# EAGLE design femtoduinoBLE (EAGLE 6.5.0)
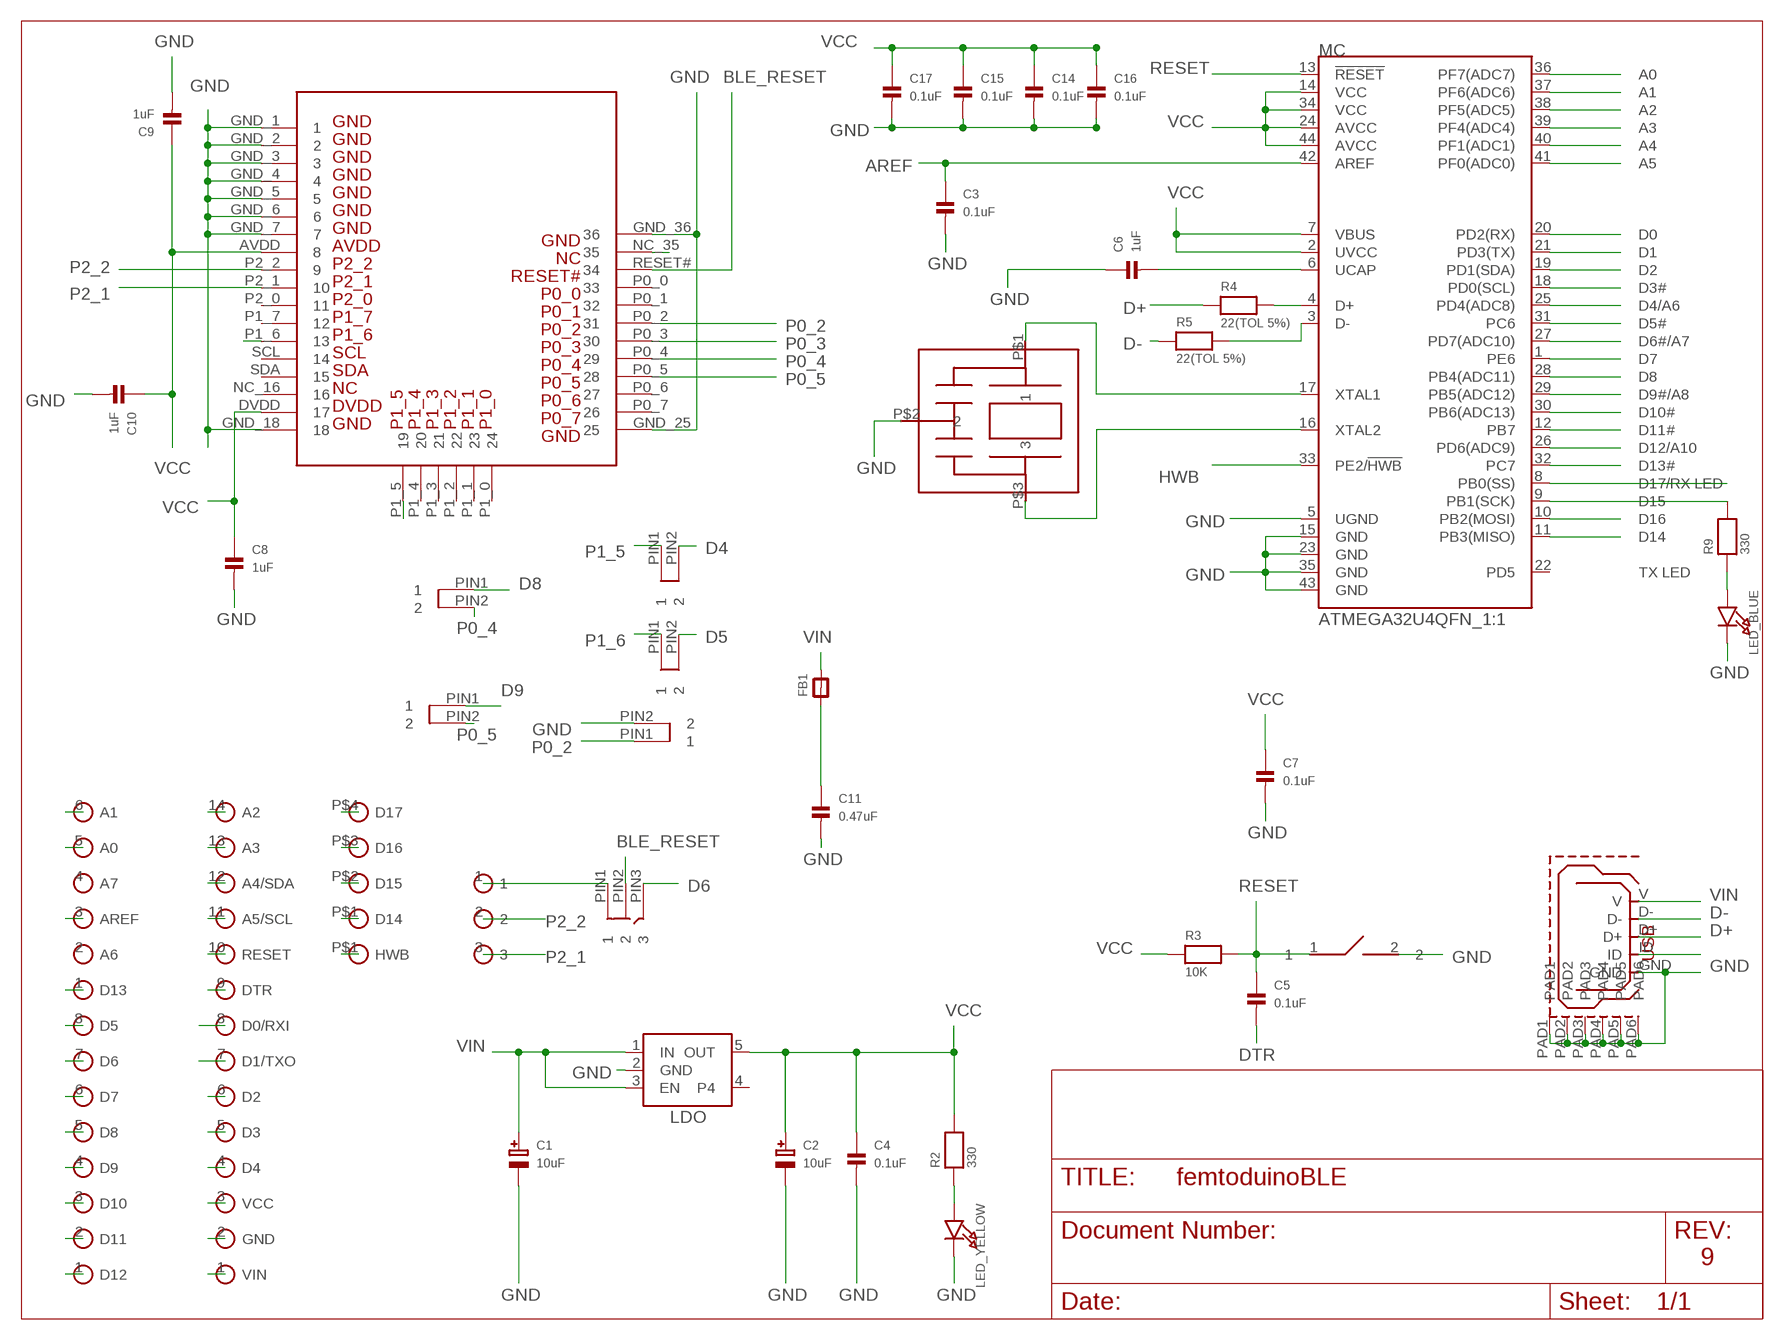
[diagram p0: schematic, sheet 1]

## Parts
BLE_CTS  DNP  SPST_SMD_BRIDGED  [SPST_SMD_BRIDGED]
C1  10uF  CAP_TANTALUMA/3216_REFLOW  [EIA3216-18/A-R]
C2  10uF  CAP_TANTALUMA/3216_REFLOW  [EIA3216-18/A-R]
C3  0.1uF  CAP_CERAMIC_0402  [_0402]
C4  0.1uF  CAP_CERAMIC_0402  [_0402]
C5  0.1uF  CAP_CERAMIC_0402  [_0402]
C6  1uF  CAP_CERAMIC_0402  [_0402]
C7  0.1uF  CAP_CERAMIC_0402  [_0402]
C8  1uF  CAP_CERAMIC0402  [0402]
C9  1uF  CAP_CERAMIC0402  [0402]
C10  1uF  CAP_CERAMIC0402  [0402]
C11  0.47uF  CAP_CERAMIC_0402  [_0402]
C14  0.1uF  CAP_CERAMIC_0402  [_0402]
C15  0.1uF  CAP_CERAMIC_0402  [_0402]
C16  0.1uF  CAP_CERAMIC_0402  [_0402]
C17  0.1uF  CAP_CERAMIC_0402  [_0402]
FB1  FERRITE  [0603]
LED_BLUE  LED0603_NOOUTLINE  [CHIPLED_0603_NOOUTLINE]
LED_YELLOW  LED0603_NOOUTLINE  [CHIPLED_0603_NOOUTLINE]
MC  ATMEGA32U4QFN_1:1  [QFN-44-NOPAD_1:1]
R2  330  RESISTOR_0402  [_0402]
R3  10K  RESISTOR_0402  [_0402]
R4  22(TOL 5%)  RESISTOR0402  [0402]
R5  22(TOL 5%)  RESISTOR0402  [0402]
R9  330  RESISTOR_0402  [_0402]
U$1  USB_MICROB  [USB_MICROB_PACKAGE]
U$2  CSTCE16MOV51-RO  [CSTCE16M0V51-RO_PACKAGE]
U$4  LDO_REGULATOR  [LDO_REGULATOR]
U$5  05_PINHEAD_1X6  [05_PINHEAD_1X6_PACKAGE]
U$6  05_PINHEAD_1X8  [05_PINHEAD_1X8_PACKAGE]
U$7  05_PINHEAD_1X14  [05_PINHEAD_1X14_PACKAGE]
U$9  DNP  SPST_SMD  [SPST_SMD]
U$10  05_PINHEAD_1X4  [05_PINHEAD_1X4_PACKAGE]
U$11  05_PINHEAD_1X1  [05_PINHEAD_1X1_PACKAGE]
U$12  BLE113-A  [BLE113-A]
U$13  DNP  SPST_SMD_BRIDGED  [SPST_SMD_BRIDGED]
U$14  DNP  SPST_SMD_BRIDGED  [SPST_SMD_BRIDGED]
U$15  DNP  SPST_SMD_BRIDGED  [SPST_SMD_BRIDGED]
U$16  DNP  SPST_SMD_BRIDGED  [SPST_SMD_BRIDGED]
U$19  DNP  SPST_3_SMD  [SPST_3_SMD]
U$20  05_PINHEAD_HEADER_1X3  [05_PINHEAD_1X3_HEAD_PACKAGE]

## Nets
A0: MC.36(PF7(ADC7)) U$5.5(A0)
A1: MC.37(PF6(ADC6)) U$5.6(A1)
A2: MC.38(PF5(ADC5)) U$7.14(A2)
A3: MC.39(PF4(ADC4)) U$7.13(A3)
A4: MC.40(PF1(ADC1)) U$7.12(A4/SDA)
A5: MC.41(PF0(ADC0)) U$7.11(A5/SCL)
AREF: C3.1 MC.42(AREF) U$5.3(AREF)
BLE_RESET: U$12.RESET# U$19.PIN2
D2: MC.19(PD1(SDA)) U$7.6(D2)
D3: MC.18(PD0(SCL)) U$7.5(D3)
D4: MC.25(PD4(ADC8)) U$7.4(D4) U$16.PIN2
D5: MC.31(PC6) U$6.8(D5) U$15.PIN2
D6: MC.27(PD7(ADC10)) U$6.7(D6) U$19.PIN3
D7: MC.1(PE6) U$6.6(D7)
D8: MC.28(PB4(ADC11)) U$6.5(D8) U$13.PIN1
D9: MC.29(PB5(ADC12)) U$6.4(D9) U$14.PIN1
D10: MC.30(PB6(ADC13)) U$6.3(D10)
D11: MC.12(PB7) U$6.2(D11)
D12: MC.26(PD6(ADC9)) U$6.1(D12)
D13: MC.32(PC7) U$5.1(D13)
D14: MC.11(PB3(MISO)) U$10.P$1(D14)
D15: MC.9(PB1(SCK)) R9.2 U$10.P$2(D15)
D16: MC.10(PB2(MOSI)) U$10.P$3(D16)
D17: MC.8(PB0(SS)) U$10.P$4(D17)
D+: R4.1 U$1.D+
D-: R5.1 U$1.D-
DTR: C5.2 U$7.9(DTR)
GND: BLE_CTS.PIN2 C1.- C2.- C3.2 C4.2 C6.1 C7.2 C8.2 C9.2 C10.2 C11.2 C14.2 C15.2 C16.2 C17.2 LED_BLUE.C LED_YELLOW.C MC.5(UGND) MC.15(GND) MC.23(GND) MC.35(GND) MC.43(GND) U$1.GND U$1.PAD1 U$1.PAD2 U$1.PAD3 U$1.PAD4 U$1.PAD5 U$1.PAD6 U$2.P$2 U$4.2(GND) U$7.2(GND) U$9.2 U$12.GND_1 U$12.GND_2 U$12.GND_3 U$12.GND_4 U$12.GND_5 U$12.GND_6 U$12.GND_7 U$12.GND_18 U$12.GND_25 U$12.GND_36
HWB: MC.33(PE2/!HWB) U$11.P$1(HWB)
N$1: C11.1 FB1.1
N$2: U$12.NC_35
N$4: LED_BLUE.A R9.1
N$5: LED_YELLOW.A R2.1
N$8: U$19.PIN1 U$20.1
N$10: U$1.ID
N$11: MC.4(D+) R4.2
N$23: MC.3(D-) R5.2
P0_2: BLE_CTS.PIN1 U$12.P0_2
P0_3: U$12.P0_3
P0_4: U$12.P0_4 U$13.PIN2
P0_5: U$12.P0_5 U$14.PIN2
P1_5: U$12.P1_5 U$16.PIN1
P1_6: U$12.P1_6 U$15.PIN1
P2_1: U$12.P2_1 U$20.3
P2_2: U$12.P2_2 U$20.2
RESET: C5.1 MC.13(!RESET) R3.2 U$7.10(RESET) U$9.1
RXI: MC.20(PD2(RX)) U$7.8(D0/RXI)
TXO: MC.21(PD3(TX)) U$7.7(D1/TXO)
UCAP: C6.2 MC.6(UCAP)
VCC: C2.+ C4.1 C7.1 C8.1 C9.1 C10.1 C14.1 C15.1 C16.1 C17.1 MC.2(UVCC) MC.7(VBUS) MC.14(VCC) MC.24(AVCC) MC.34(VCC) MC.44(AVCC) R2.2 R3.1 U$4.5(OUT) U$7.3(VCC) U$12.AVDD U$12.DVDD
VIN: C1.+ FB1.2 U$1.V U$4.1(IN) U$4.3(EN) U$7.1(VIN)
XTAL1: MC.17(XTAL1) U$2.P$1
XTAL2: MC.16(XTAL2) U$2.P$3
Unconnected: MC.22(PD5) U$4.4 U$5.2(A6) U$5.4(A7) U$12.NC_16 U$12.P0_0 U$12.P0_1 U$12.P0_6 U$12.P0_7 U$12.P1_0 U$12.P1_1 U$12.P1_2 U$12.P1_3 U$12.P1_4 U$12.P1_7 U$12.P2_0 U$12.SCL U$12.SDA

## Notes on the sheet
- 9

## Library data of the parts
BLE_CTS U$13-U$16 = ftdi_ft231xq-r:SPST_SMD_BRIDGED
C1 C2 = microbuilder:CAP_TANTALUM: Tantalum Capacitors Wave footprints have larger pads and are meant to be used for hand soldering. Reflow footprints are optimised for solder paste and a reflow oven. EIA3216-18/A-[R/W] - Size A / 3216-18 / 1206 footprint 4.7µF 25V 10% Tantalum Capacitor 10µF 16V 10% Tantalum Capacitor [Digikey: 495-2236-2-ND] EIA3528-21/B-[R/W] - Size B / 3528-21 47µF 10V 10% Tantalum Capactior [Digikey: 495-2216-1-ND] EIA6032-28/C-[R/W] - Size C / 6032-28 10µF 35V 20% Tantalum Capacitor [Digikey: 495-2285-1-ND] 100µF 16V 10% Tantalum Capactior [Digikey: 399-5214-1-ND]
C3-C11 C14-C17 = microbuilder:CAP_CERAMIC: Ceramic Capacitors 0402 - 0402 Surface Mount Capacitors 16pF 50V 5% [Digikey: 445-4899-2-ND] 18pF 50V 5% [Digikey: 490-1281-2-ND] 22pF 50V 5% [Digikey: 490-1283-2-ND] 68pF 50V 5% [Digikey: 490-1289-2-ND] 0.1uF 10V 10% [Digikey: 490-1318-2-ND] 1.0uF 6.3V 10% [Digikey: 490-1320-2-ND] 0603 - 0603 Surface Mount Capacitors 16 pF 50V 5% [Digikey: 445-5051-2-ND] 22 pF 50V [Digikey: PCC220ACVTR-ND] 33 pF 50V 5% [Digikey: 490-1415-1-ND] 56pF 50V 5% [Digikey: 490-1421-1-ND] 220pF 50V 5% [Digikey: 445-1285-1-ND] 680 pF 50V 2200 pF 50V 5% C0G [Digikey: 445-1297-1-ND] 5600 pF 100V 5% X7R [Digikey: 478-3711-1-ND] 0.1 µF 25V 10% [Digikey: PCC2277TR-ND] 0.22 µF 16V 10% X7R [Digikey: 445-1318-1-ND] 1.0 µF 25V 10% [Digikey: 445-5146-2-ND] 0603 - RF Specific 3pF 250V +/-0.1pF RF [Digikey: 712-1347-1-ND] 18 pF 250V 5% [Digikey: 478-3505-1-ND or 712-1322-1-ND] 56 pF 250V 5% C0G RF [Digikey: 490-4867-1-ND] 68 pF 250V RF [Digikey: 490-4868-1-ND] 0805 - 0805 Surface Mount Capacitors 220 pF 250V 2% RF Ceramic Capacitor [Digikey: 712-1398-1-ND] 1000 pF 50V 2% NP0 Ceramic Capacitor [Digikey: 478-3760-1-ND] 0.1 µF 25V 10% Ceramic Capacitor [Digikey: PCC1828TR-ND] 1.0 µF 16V 10% Ceramic Capacitor[Digikey: 490-1691-2-ND] 10.0 µF 10V 10% Ceramic Capacitor[Digikey: 709-1228-1-ND] 10.0 uF 16V 10% Ceramic Capacitor [Digikey: 478-5165-2-ND] 47 uF 6.3V 20% Ceramic Capacitor [Digikey: 587-1779-1-ND or 399-5506-1-ND] 1206 - 1206 Surface Mount Capacitors 47uF 10V 20% Ceramic Capacitor [Digikey: 490-5528-1-ND or 399-5508-1-ND or 445-6010-1-ND] 100uF 6.3V -20%, +80% Y5V Ceramic Capacitor (Digikey: 490-4512-1-ND, Mouser: 81-GRM31CF50J107ZE1L)
FB1 = microbuilder:FERRITE: Ferrite Bead 0603 MMZ1608B121C - 120 Ohm @ 100MHz, 600mA, 0.15 Ohm DC Resistance - Digikey: 445-2164-1-ND BK1608HW121-T - 120 Ohm, 600mA Ferrite Chip - Digikey: 587-1876-2-ND 0805 HZ0805B272R-10 - 2.7K Ohm @ 100MHz, 200mA, 0.8 Ohm DC Resistance - Digikey: 240-2504-1-ND (see also Murata BLM21BD272SN1L) MMZ2012Y152B - 1.5K Ohm @ 100MHz, 500mA, 0.4 Ohm DC Resistance - Digikey: 445-1560-1-ND - Mainly for high frequency (80-400MHz) MMZ2012R102A - 1K Ohm @ 100MHz, 500mA, 0.3 Ohm DC Resistance - Digikey: 445-1555-2-ND - More general purpose (10-200MHz)
LED_BLUE LED_YELLOW = microbuilder:LED: LED 0603 - 0603 Surface Mount Package 2mA: Green LED - Low Power (3.9mcd, 2ma, 1.7Vf) - Digikey: 475-2709-2-ND Orange LED - Low Power (9.8mcd, 2ma, 1.8Vf) - Digikey: 475-1194-2-ND Red LED - Low Power (5mcd, 2ma, 1.8Vf) - Digikey: 475-1195-2-ND Yellow LED - Low Power (7mcd, 2ma, 1.8Vf) - Digikey: 475-1196-2-ND 5mA: Blue LED - Low Power (17mcd, 5ma, 2.9Vf) - Digikey: LNJ937W8CRACT-ND 0805 - 0805 Surface Mount Package 2mA: Red LED (8.8mcd, 2mA, 1.8Vf, Clear) - Low Power [Digikey: 475-2510-1-ND] Green LED (5mcd, 2mA, 1.8Vf, Clear) - Low Power [Digikey: 475-2730-1-ND] Yellow LED (11.3mcd, 2mA, 1.8Vf, Clear) - Low Power [Digikey: 475-2555-1-ND] 20mA: Red LED (104mcd, 20mA, Diffused) - LS R976 [Digikey: 475-1278-6-ND] Red LED (12mcd, 20mA, 2.0Vf, Clear) - APT2012EC [Digikey: 754-1128-1-ND] Green LED (15mcd, 20mA, 2.2Vf, Clear) - APT2012GC [Digikey: 754-1131-1-ND] Orange LED (160mcd, 20mA, 2.1Vf, Clear) - APT2012SECK [Digikey: 754-1130-1-ND] 1206 - 1206 Surface Mount Package Green LED (26mcd, 20mA, Diffused) - LG N971 [Digikey: 475-1407-6-ND] Red LED (15mcd, 20mA, Diffused) - LH N974 [Digikey: 475-1416-6-ND]
MC = SparkFun-DigitalIC:ATMEGA32U4: Atmel 44-pin 8-bit Microcontroller with 32KBytes of ISP Flash and USB Controller ----- Please use the QFN-44-NOPAD_1:1 package for the footprint of all boards using a 32U4. Route traces directly away from the pads as much as possible.
R2-R5 R9 = microbuilder:RESISTOR: Resistors 0402 - 0402 Surface Mount Package 22 Ohm 1% 1/16W [Digikey: 311-22.0LRTR-ND] 33 Ohm 5% 1/16W 1.0K 5% 1/16W 1.5K 5% 1/16W 2.0K 1% 1/16W 10.0K 1% 1/16W [Digikey: 311-10.0KLRTR-ND] 10.0K 5% 1/16W [Digikey: RMCF0402JT10K0TR-ND] 12.1K 1% 1/16W [Digikey: 311-22.0LRTR-ND] 100.0K 5% 1/16W 0603 - 0603 Surface Mount Package 0 Ohm 1/10 Watt 1% Resistor 15 Ohm 1/10 Watt 1% Resistor 33 Ohm 1/10 Watt 1% Resistor 49.9 Ohm 1/10 Watt 1% Resistor 100 Ohm 1/10 Watt 1% Resistor 150 Ohm 1/10 Watt 1% Resistor 240 Ohm 1/10 Watt 1% Resistor 390 Ohm 1/10 Watt 1% Resistor 560 Ohm 1/10 Watt 1% Resistor 680 Ohm 1/10 Watt 1% Resistor 750 Ohm 1/10 Watt 1% Resistor 1.0K Ohm 1/10 Watt 1% Resistor 1.5K Ohm 1/10 Watt 1% Resistor 2.0K Ohm 1/10 Watt 1% Resistor 2.2K Ohm 1/10 Watt 1% Resistor 3.3K Ohm 1/10 Watt 1% Resistor 4.7K Ohm 1/10 Watt 1% Resistor 10.0K Ohm 1/10 Watt 1% Resistor 12.0K Ohm 1/10 Watt 1% Resistor 12.1K Ohm 1/10 Watt 1% Resistor 20.0K Ohm 1/10 Watt 1% Resistor 33.0K Ohm 1/10 Watt 1% Resistor 100.0K Ohm 1/10 Watt 1% Resistor 0805 - 0805 Surface Mount Package 0 Ohm 1/8 Watt 1% Resistor 33 Ohm 1/8 Watt 1% Resistor 100 Ohm 1/8 Watt 1% Resistor 150 Ohm 1/8 Watt 1% Resistor 200 Ohm 1/8 Watt 1% Resistor 240 Ohm 1/8 Watt 1% Resistor 330 Ohm 1/8 Watt 1% Resistor 390 Ohm 1/8 Watt 1% Resistor 470 Ohm 1/8 Watt 1% Resistor 1.0K Ohm 1/8 Watt 1% Resistor 1.5K Ohm 1/8 Watt 1% Resistor 2.0K Ohm 1/8 Watt 1% Resistor 4.7K Ohm 1/8 Watt 1% Resistor 5.1K Ohm 1/8 Watt 1% Resistor 5.6K Ohm 1/8 Watt 1% Resistor 10.0K Ohm 1/8 Watt 1% Resistor 22.0K Ohm 1/8 Watt 1% Resistor 33.0K Ohm 1/8 Watt 1% Resistor 100K Ohm 1/8 Watt 1% Resistor 1206 - 1206 Surface Mount Package 2012 - 2010 Surface Mount Package 0.11 Ohm 1/2 Watt 1% Resistor - Digikey: RHM.11UCT-ND
U$1 = femtoduino:USB_MICROB: This is the hirose ZX62-B-5PA(11) MICRO-USB B Type female connection.
U$2 = femtoduino:CSTCE16MOV51-RO: This is the CSTCE16M0V51-R0 Murata resonator (CERALOCK) 16Mhz 0.5% Tolerance
U$4 = femtoduino:LDO_REGULATOR
U$5 = femtoduino:05_PINHEAD_1X6
U$6 = femtoduino:05_PINHEAD_1X8
U$7 = femtoduino:05_PINHEAD_1X14
U$9 = femtoduino:SPST_SMD
U$10 = femtoduino:05_PINHEAD_1X4
U$11 = femtoduino:05_PINHEAD_1X1
U$12 = BLE113-A:BLE113-A
U$19 = ftdi_ft231xq-r:SPST_3_SMD
U$20 = femtoduino:05_PINHEAD_HEADER_1X3

## Board
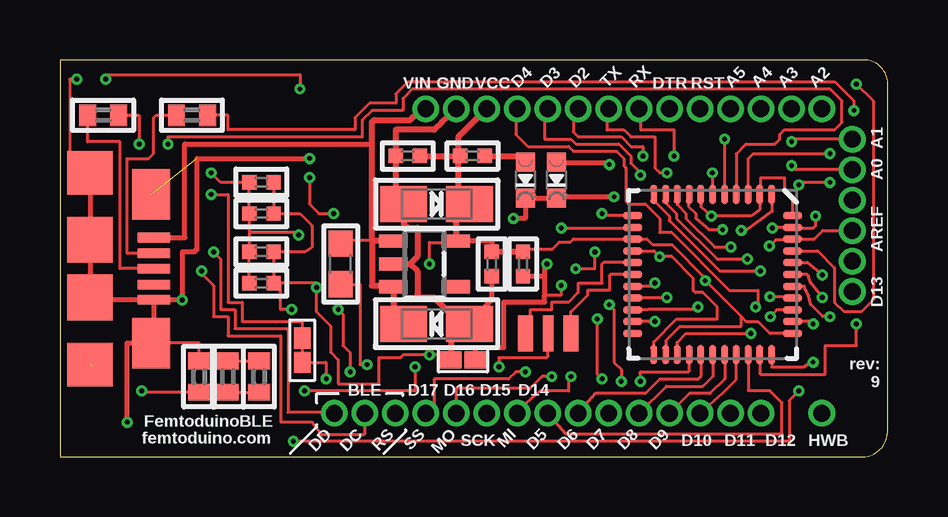
[diagram p1: board, top side]
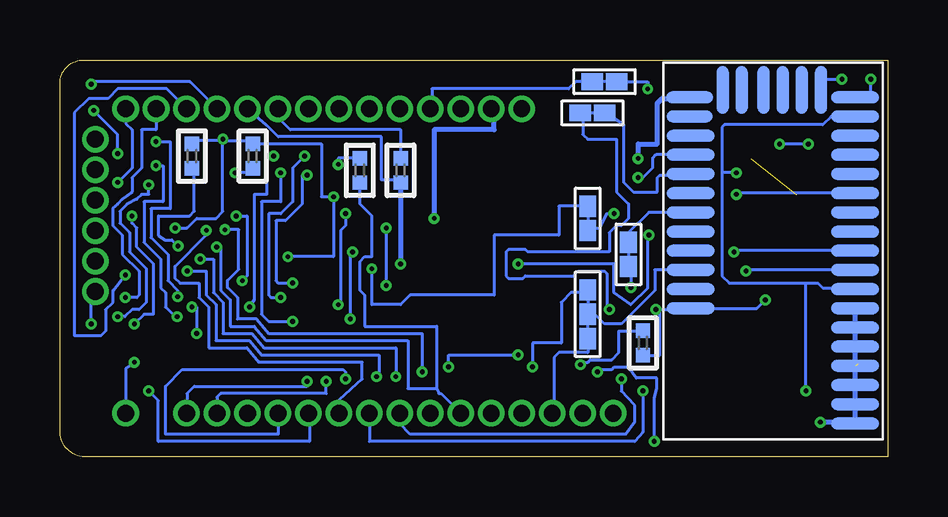
[diagram p2: board, bottom side, seen from below]

Size 34.5 x 16.56 mm. Coordinates in mm from the lower left corner, seen from the top.
Outline: 0,0 33.38,0 arc90 34.5,1.02 34.5,15.67 arc90 33.42,16.55 0,16.55 0,0
Copper layers (1+2*15+16): Top 0.035mm / dielectric 1.5mm / Route2 0.035mm / dielectric 0.15mm / Route15 0.035mm / dielectric 0.2mm / Bottom 0.035mm
Design rules "femtoduino_5mil_4layer *": minimum track width 5mil, minimum drill 2mil, track to track 5mil, track to pad 5mil, pad to pad 5mil, via to via 5mil, smd to smd 5mil, copper to edge 5mil, drill to drill 5mil, minimum pad ring 8mil, minimum via ring 5mil, stop-mask expansion 2mil, vias tented up to drill 30mil, thermal gap 10mil

### Footprints (pad centres in the part's own frame; a part is rotated, then mirrored left to right if it is on the bottom)
SPST_SMD_BRIDGED = smd 0.889 x 0.699: PIN1 -0.508,0; PIN2 0.508,0
EIA3216-18/A-R = smd 1.95 x 1.5: + 1.375,0; - -1.375,0
_0402 = smd 0.6 x 0.6: 1 -0.508,0; 2 0.508,0
0402 = smd 0.7 x 0.9: 1 -0.65,0; 2 0.65,0
0603 = smd 1.1 x 1: 1 -0.85,0; 2 0.85,0
CHIPLED_0603_NOOUTLINE = smd 0.8 x 0.8: A 0,-0.75; C 0,0.75
QFN-44-NOPAD_1:1 = smd 0.8 x 0.3: 1 -3.337,2.458; 2 -3.337,1.958; 3 -3.337,1.479; 4 -3.337,0.979; 5 -3.337,0.5; 6 -3.337,0; 7 -3.337,-0.5; 8 -3.337,-0.979; 9 -3.337,-1.479; 10 -3.337,-1.958; 11 -3.337,-2.458; 23 3.337,-2.458; 24 3.337,-1.958; 25 3.337,-1.479; 26 3.337,-0.979; 27 3.337,-0.5; 28 3.337,0; 29 3.337,0.5; 30 3.337,0.979; 31 3.337,1.479; 32 3.337,1.958; 33 3.337,2.458 | smd 0.3 x 0.8: 12 -2.458,-3.337; 13 -1.958,-3.337; 14 -1.479,-3.337; 15 -0.979,-3.337; 16 -0.5,-3.337; 17 0,-3.337; 18 0.5,-3.337; 19 0.979,-3.337; 20 1.479,-3.337; 21 1.958,-3.337; 22 2.458,-3.337; 34 2.458,3.337; 35 1.958,3.337; 36 1.479,3.337; 37 0.979,3.337; 38 0.5,3.337; 39 0,3.337; 40 -0.5,3.337; 41 -0.979,3.337; 42 -1.479,3.337; 43 -1.958,3.337; 44 -2.458,3.337
USB_MICROB_PACKAGE = smd 0.4 x 1.35: D+ 0,-0.68; D- -0.64,-0.68; GND 1.3,-0.68; ID 0.66,-0.68; V -1.3,-0.68 | smd 2.1 x 1.6: PAD1 -3.1,-0.8; PAD2 3.1,-0.8 | smd 1.8 x 1.9: PAD3 -4,-3.35; PAD6 4,-3.35 | smd 1.9 x 1.9: PAD4 -1.2,-3.35; PAD5 1.2,-3.35
CSTCE16M0V51-RO_PACKAGE = smd 1.5 x 0.62: P$1 0,1.9; P$3 0,0 | smd 1.5 x 0.45: P$2 0,0.95
LDO_REGULATOR = smd 0.55 x 1.2: 1 -0.95,-1.3; 2 0,-1.3; 3 0.95,-1.3; 4 0.95,1.3; 5 -0.95,1.3
05_PINHEAD_1X6_PACKAGE = drill 0.7 pad 1.016: 1 0,0; 2 0,1.27; 3 0,2.54; 4 0,3.81; 5 0,5.08; 6 0,6.35
05_PINHEAD_1X8_PACKAGE = drill 0.7 pad 1.016: 1 0,0; 2 0,1.27; 3 0,2.54; 4 0,3.81; 5 0,5.08; 6 0,6.35; 7 0,7.62; 8 0,8.89
05_PINHEAD_1X14_PACKAGE = drill 0.7 pad 1.016: 1 0,0; 2 0,1.27; 3 0,2.54; 4 0,3.81; 5 0,5.08; 6 0,6.35; 7 0,7.62; 8 0,8.89; 9 0,10.16; 10 0,11.43; 11 0,12.7; 12 0,13.97; 13 0,15.24; 14 0,16.51
SPST_SMD = smd 0.889 x 0.699: 1 -0.508,0; 2 0.508,0
05_PINHEAD_1X4_PACKAGE = drill 0.7 pad 1.016: P$1 0,0; P$2 0,1.27; P$3 0,2.54; P$4 0,3.81
05_PINHEAD_1X1_PACKAGE = drill 0.7 pad 1.016: P$1 0,0
BLE113-A = smd 2 x 0.5: AVDD 1.15,9.45; DVDD 1.15,2.25; GND_1 1.15,15.05; GND_2 1.15,14.25; GND_3 1.15,13.45; GND_4 1.15,12.65; GND_5 1.15,11.85; GND_6 1.15,11.05; GND_7 1.15,10.25; GND_18 1.15,1.45; GND_36 8,10.25; NC_16 1.15,3.05; NC_35 8,9.45; P0_0 8,7.85; P0_1 8,7.05; P0_2 8,6.25; P0_3 8,5.45; P0_4 8,4.65; P0_5 8,3.85; P0_6 8,3.05; P1_6 1.15,5.45; P1_7 1.15,6.25; P2_0 1.15,7.05; P2_1 1.15,7.85; P2_2 1.15,8.65; RESET# 8,8.65; SCL 1.15,4.65; SDA 1.15,3.85 | smd 1.95 x 0.5: GND_25 8.05,1.45 | smd 1.9 x 0.5: P0_7 8.05,2.25 | smd 0.5 x 2: P1_0 6.675,1.15; P1_1 5.875,1.15; P1_2 4.975,1.15; P1_3 4.175,1.15; P1_4 3.375,1.15; P1_5 2.575,1.15
SPST_3_SMD = smd 0.889 x 0.699: PIN1 -1.016,0; PIN2 0,0; PIN3 1.016,0
05_PINHEAD_1X3_HEAD_PACKAGE = drill 0.7 pad 1.016: 1 0,0; 2 0,-1.27; 3 0,-2.54

### Placement (x,y rotation side)
BLE_CTS  10.8,8.45 270 bottom
C1  15.7,5.55 180 top
C2  15.7,10.55 0 top
C3  29,12.55 90 bottom
C4  14.5,12.55 180 top
C5  20.3,11.95 90 bottom
C6  26.47,12.55 270 bottom
C7  18,8.05 270 top
C8  5.8,3.35 90 top
C9  7,3.35 90 top
C10  8.3,3.35 90 top
C11  10.2,4.75 270 bottom
C14  8.4,7.25 0 top
C15  8.4,8.55 0 top
C16  8.4,10.15 0 top
C17  8.4,11.45 0 top
FB1  11.7,8.05 90 top
LED_BLUE  20.7,11.55 180 top
LED_YELLOW  19.4,11.55 180 top
MC  27.21,7.61 270 top
R2  17.2,12.55 180 top
R3  19.3,8.05 270 top
R4  1.8,14.25 0 top
R5  5.5,14.25 0 top
R9  22,11.95 270 bottom
U$1  4.6,7.85 270 top
U$2  19.4,5.15 270 top
U$4  15.2,8.05 270 top
U$5  33.03,6.9 0 top
U$6  29.22,1.82 90 top
U$7  15.25,14.52 270 top
U$9  16.8,4.05 180 top
U$10  19.06,1.82 90 top
U$11  31.76,1.82 0 top
U$12  0.2,16.45 180 bottom
U$13  12.3,14.35 0 bottom
U$14  12.5,9.95 270 bottom
U$15  10.1,4.45 270 top
U$16  11.8,15.65 180 bottom
U$19  12.5,5.95 90 bottom
U$20  13.98,1.82 270 top

### Tracks (layer width: path | path; a pad name or v marks a point on that pad's centre or on a via)
A0  (via drill 0.2)
  Top 0.127: U$5.5 30.67,11.98 v30.5,12.15 | MC.36 29.88,6.13 v29.62,5.85
  Bottom 0.127: v30.5,12.15 30.2,12.15 30.2,10.65 31,10.65 31,8.95 30.3,8.25 30.3,7.05 30.1,6.85 30.1,6.25 29.7,5.85 v29.62,5.85
A1  (via drill 0.2)
  Top 0.127: U$5.6 30.6,13.25 v30.5,13.15 | MC.37 30.53,6.65 30.53,6.68 v29.6,6.68
  Bottom 0.127: v30.5,13.15 29.9,13.15 29.9,10.35 30.7,10.35 30.7,9.15 30,8.45 30,7.35 29.6,6.95 v29.6,6.68
A2  (via drill 0.2)
  Top 0.127: MC.38 31.04,7.11 31.1,6.95 31.2,6.75 31.3,6.35 31.8,5.85 v32.1,5.85 | v32.1,11.45 30.9,11.45 v30.8,11.35
  Bottom 0.127: U$7.14 31.76,13.91 31.5,13.65 31.5,12.05 v32.1,11.45 | v30.8,11.35 30.8,10.95 31.1,10.95 31.3,10.75 31.7,10.55 32,10.25 32,9.75 31.6,9.35 31.6,8.55 30.9,7.85 30.9,6.45 31.2,6.15 31.5,6.15 31.8,5.85 v32.1,5.85
A3  (via drill 0.2)
  Top 0.127: 30.94,7.61 MC.39 31.14,7.61 31.2,7.55 31.3,7.25 v31.77,6.66
  Bottom 0.127: U$7.13 30.49,13.66 30.5,13.65 31.1,13.65 31.1,12.05 31.5,11.65 31.5,11.05 31.9,10.75 32.1,10.55 32.3,10.38 32.3,9.65 31.9,9.25 31.9,8.45 31.2,7.75 31.2,6.75 31.3,6.65 v31.77,6.66
A4  (via drill 0.2)
  Top 0.127: MC.40 31.16,8.11 v31.77,7.58
  Bottom 0.127: U$7.12 30.05,15.35 32.1,15.35 32.5,14.95 33.3,14.95 33.9,14.35 33.9,5.05 32.8,5.05 32.6,5.25 32.6,6.15 32.28,6.45 32.28,6.95 v31.77,7.58
A5  (via drill 0.2)
  Top 0.127: MC.41 31.59,8.59 32.28,7.88 32.28,6.45 32.7,6.05 33.4,6.05 33.9,6.55 33.9,14.85 v33.2,15.55
  Bottom 0.127: U$7.11 29.08,15.65 33.1,15.65 v33.2,15.55
AREF  (via drill 0.2)
  Top 0.127: U$5.3 31.8,9.45 31.44,9.09 MC.42 30.51,9.05 29.84,9.05 v29.58,8.8
  Bottom 0.127: 28.95,11.85 C3.1 28.9,11.8 28.9,10.25 29.1,10.05 30.4,10.05 30.4,9.24 30.12,9.05 29.84,9.05 v29.58,8.8
BLE_RESET
  Bottom 0.127: U$12.RESET# 9.7,7.8 9.7,6.95 11.1,5.55 11.8,5.55 12.2,5.95 U$19.PIN2
D2  (via drill 0.2)
  Top 0.127: U$7.6 21.4,14.42 21.4,13.55 21.6,13.35 23.4,13.35 23.8,12.95 24.3,12.95 v24.3,12.55 | v25.3,6.65 25.18,6.63 MC.19
  Bottom 0.127: v24.3,12.55 24.8,12.05 24.8,10.65 25.3,10.15 25.8,10.15 25.8,6.75 25.7,6.65 v25.3,6.65 | U$7.6
D3  (via drill 0.2)
  Top 0.127: U$7.5 20.2,14.45 20.2,13.25 21.3,13.25 21.5,13.05 23.3,13.05 23.8,12.55 23.8,12.25 24.2,11.85 v24.2,11.75 | v24.8,7.25 24.66,7.11 MC.18
  Bottom 0.127: v24.2,11.75 24.4,11.75 24.4,10.55 25.1,9.85 25.5,9.85 25.5,7.35 25.4,7.25 v24.8,7.25
D4  (via drill 0.2)
  Top 0.127: U$7.4 19,14.48 19,13.45 19.5,12.95 21.2,12.95 21.4,12.75 23.2,12.75 23.5,12.45 23.5,12.15 23.6,12.05 23.6,10.65 23.7,10.55 24.4,10.55 25,9.95 25,9.35 25.5,9.35 27.9,6.95 29.1,6.95 29.1,6.25 v29,6.25 | MC.25 25.73,4.78 26.1,5.15 v28.8,5.15
  Bottom 0.127: v29,6.25 28.8,6.25 v28.8,5.15 | U$16.PIN2 13,15.65 13.3,15.35 19,15.35 19,14.58 U$7.4
D5  (via drill 0.2 pad 0.25)
  Top 0.127: MC.31 28.69,2.76 29.6,2.76 30.1,2.26 30.1,0.95 21.1,0.95 U$6.8 | U$15.PIN2 11.09,3.95 v11.1,3.25
  Bottom 0.127: v11.1,3.25 11.1,2.75 10.54,2.15 10.54,1.47 10.92,0.95 19.9,0.95 20.33,1.38 U$6.8
D6  (via drill 0.2 pad 0.25)
  Top 0.127: U$6.7 22.33,2.65 24.4,2.65 25,3.25 26.6,3.25 26.71,3.36 MC.27 | v14.8,3.75 14.8,2.75 v10.2,2.75
  Bottom 0.127: U$19.PIN3 12.62,6.85 13.2,6.85 13.6,6.45 13.6,4.75 14.8,4.75 v14.8,3.75 | v10.2,2.75 10.2,1.03 10.54,0.65 21.6,0.65 U$6.7
D7  (via drill 0.2)
  Top 0.127: v28.4,9.45 28.6,9.45 29.7,10.25 29.7,10.91 MC.1
  Bottom 0.127: v28.4,9.45 28.4,9.25 29.7,7.95 29.7,7.45 29.5,7.25 28.7,7.25 28.7,6.65 28.3,6.25 28.3,4.55 26.7,4.55 26.2,3.95 21.9,3.95 21.9,3.25 22.87,2.38 U$6.6
D8  (via drill 0.2)
  Top 0.127: MC.28 27.21,3.36 26.8,2.95 25.27,2.95 U$6.5 | v11.6,6.15 11.8,5.95 11.8,4.65 12.1,4.35 v12.1,3.55 | v30.8,2.75 30.4,2.35 30.4,0.65 v9.73,0.65
  Bottom 0.127: U$13.PIN1 12.7,14.24 12.7,13.45 12.5,13.25 11.3,13.25 11.3,11.05 10.8,10.55 10.8,9.95 11.1,9.65 11.3,9.65 11.6,9.35 11.6,8.55 15,8.55 15.1,8.65 15.8,8.65 15.9,8.55 15.9,7.55 15.8,7.45 15.2,7.45 15.1,7.55 13.1,7.55 12.9,7.75 11.8,7.75 11.7,7.65 11.7,6.25 v11.6,6.15 | U$6.5 24.1,1.78 24.1,0.65 30.4,0.65 30.4,2.35 v30.8,2.75 | v12.1,3.55 12,3.65 11.5,3.65 11.4,3.75 10.8,3.75 10.47,3.3 9.62,3.3 9.62,2.87 9.73,2.47 v9.73,0.65
D9  (via drill 0.2)
  Top 0.127: U$6.4 26.24,2.65 27.1,2.65 27.71,3.26 MC.29 | v22.6,3.25 22.4,3.45 v22.4,5.75 | v21.5,7.85 22.3,7.85 v22.3,8.55
  Bottom 0.127: U$14.PIN1 13.7,10.46 13.7,9.25 16.4,9.25 16.4,6.75 19.9,6.75 20.3,6.35 21.5,6.35 v21.5,7.85 | U$6.4 25.4,0.95 30.1,0.95 30.1,2.95 29.4,3.65 22.7,3.65 22.6,3.55 v22.6,3.25 | v22.3,8.55 22.4,8.45 v22.4,5.75
D10
  Top 0.127: U$6.3 27.61,2.65 28.19,3.23 MC.30
D11  (via drill 0.2)
  Top 0.127: MC.12 22.68,10.07 v22.6,10.15 | v22.9,6.35 23.1,6.15 23.1,3.95 23.4,3.65 v23.4,3.15
  Bottom 0.127: U$6.2 27.95,2.5 27.8,2.65 23.4,2.65 v23.4,3.15 | v22.6,10.15 22.6,9.65 22.8,9.45 22.8,6.45 v22.9,6.35
D12  (via drill 0.2)
  Top 0.127: v24.2,3.15 24.2,3.55 26.2,3.55 26.23,3.58 MC.26
  Bottom 0.127: U$6.1 29.2,1.84 29.2,2.65 28.9,2.95 24.2,2.95 v24.2,3.15
D13  (via drill 0.2)
  Top 0.127: MC.32 29.17,3.48 29.2,3.45 31.9,3.45 31.9,4.65 33.21,4.65 33.21,5.25 v33.2,5.55
  Bottom 0.127: v33.2,5.55 33.2,6.73 U$5.1
D14  (via drill 0.2)
  Top 0.127: MC.11 24.75,10.7 25.4,10.05 25.4,9.85 27.5,7.75 v29.2,7.75 | v21.3,3.35 21.2,3.35 21.2,2.75 20,2.75 19.06,1.91 U$10.P$1
  Bottom 0.127: v29.2,7.75 28.4,7.75 28.4,6.75 28,6.35 28,4.85 26.6,4.85 26.1,4.25 21.2,4.25 21.2,3.35 v21.3,3.35
D15  (via drill 0.2)
  Top 0.127: MC.9 25.73,10.52 26.1,10.15 26.1,9.95 27.3,8.75 v27.97,8.75
  Bottom 0.127: 22.05,11.35 R9.2 22,10.55 21.5,10.05 21.5,8.35 21.8,8.35 22,8.15 22,6.95 21.8,6.75 21.8,5.45 18.8,5.45 18.8,2.85 | 18.8,2.85 18.7,2.65 18.62,2.65 U$10.P$2 | v27.97,8.75 27.8,8.75 27.8,6.95 27.4,6.55 27.4,5.45 26.4,5.45 25.9,4.85 20,4.85 20,2.85 18.8,2.85
D16  (via drill 0.2)
  Top 0.127: MC.10 25.25,10.6 25.7,10.15 25.7,9.95 27.4,8.25 v28.65,8.25 | v20.5,3.35 20.1,3.35 19.6,2.85 16.5,2.85 16.5,1.84 U$10.P$3
  Bottom 0.127: v28.65,8.25 28.1,8.25 28.1,6.85 27.7,6.45 27.7,5.15 26.5,5.15 26,4.55 20.5,4.55 v20.5,3.35
D17  (via drill 0.2)
  Top 0.127: MC.8 26.2,10.92 26.2,10.45 26.5,10.15 26.5,9.95 27.05,9.48 v27.63,9.48 | v19.4,3.55 19,3.55 18.7,3.25 15.6,3.25 15.6,2.17 U$10.P$4
  Bottom 0.127: v19.4,3.55 19.4,5.15 25.8,5.15 26.3,5.75 27.1,5.75 27.1,6.65 27.51,7.06 27.51,7.36 27.05,7.82 27.05,9.48 v27.63,9.48
D+
  Top 0.127: U$1.D+ 2.5,7.85 2.5,13.15 1.15,13.15 R4.1
D-
  Top 0.127: U$1.D- 2.8,8.49 2.8,12.45 3.7,12.45 3.9,12.65 3.9,14.15 4,14.25 R5.1
DTR
  Bottom 0.127: C5.2 20.3,13.65 24.9,13.65 25.41,14.16 U$7.9
GND  (via drill 0.2, 0.2 pad 0.25)  (2 unrouted)
  Top 0.127: U$2.P$2 20.35,4.2 20.3,4.15 18.3,4.15 v18.3,3.75 | 16.09,4.25 v15.4,4.25 14.3,4.25 14.2,4.15 13.3,4.15 13.3,3.05 11.6,3.05 11.6,4.05 11.3,4.35 11.3,5.45 10.7,6.05 v10.7,7.06 10.7,7.25 C14.2 | MC.5 v27.71,13.25 | MC.15 24.76,8.59 v25,8.35 25.5,8.35 26.4,7.45 26.4,6.95 26.5,6.85 26.8,6.85 27.4,6.25 27.4,5.75 25.7,5.75 24.75,4.8 MC.23 | v29.7,9.55 29.72,9.57 MC.43 30.56,9.55 31.4,9.55 31.5,9.65 v31.5,10.05 | MC.35 31.3,5.65 v31.4,5.55 | v0.7,15.75 0.4,15.75 0.4,11.85 U$1.PAD3 | C17.2 C16.2 10,10.15 10.5,9.65 10.5,8.75 10.2,8.55 C15.2 C14.2 | v9.65,6.15 9.2,6.15 9.2,7.2 C14.2 | U$1.PAD2 5.8,4.75 C8.2 C9.2 C10.2
  Top 0.2: U$1.PAD3 U$1.PAD4 U$1.PAD5 1.25,6.55 U$1.GND | v23.1,10.85 20.85,10.85 LED_BLUE.C LED_YELLOW.C 19.4,9.95 v18.9,9.95 | 16.6,3.86 U$9.2 16.09,4.25 | C1.- 17.07,5.63 18,6.55 C7.2 | U$1.GND v5.1,6.55 5.1,8.55 5.6,8.55 5.7,8.65 5.7,12.45 v10.4,12.45 | U$1.GND 3.92,4.75 U$1.PAD2 2.8,4.75 v2.8,1.45
  Top 0.254: 14.6,8.05 14.9,8.35 14.9,9.55 14.5,9.55 14.32,9.73 C2.- 13.99,11.03 C4.2 13.99,13.65 15.6,13.65 15.92,13.97 U$7.2 | U$4.2 14.6,8.05 | 14.6,8.05 14.9,7.75 14.9,6.75 15,6.65 15.6,6.65 16.7,5.55 C1.- 17.1,5.53 16.7,5.25 16.29,5.24 U$9.2 | 20.4,5.1 U$2.P$2
  Bottom 0.127: 26.25,13.05 C6.1 26.2,13.05 23.6,13.05 23.6,10.85 v23.1,10.85 23.1,8.35 v25,8.35 | 27.7,13.2 v27.71,13.25 27.71,10.24 28,9.95 28.8,9.95 29.2,9.55 v29.7,9.55 | v31.5,10.05 31.5,9.75 31.3,9.55 31.3,8.75 30.6,8.05 30.6,5.95 31,5.95 v31.4,5.55 | v18.3,3.75 18.3,4.25 v15.4,4.25 | U$12.GND_18 0.7,15 v0.7,15.75 | v5.1,6.55 5.45,6.2 U$12.GND_36 8.25,6.15 9.5,6.15 | BLE_CTS.PIN2 10.7,7.75 v10.7,7.06 | C11.2 9.5,4.24 9.5,6.15 | 9.5,6.15 v9.65,6.15 | 27.7,13.2 26.4,13.2 | 27.7,13.2 29,13.2 C3.2
  Bottom 0.2: v18.9,9.95 18.9,13.65 16.4,13.65 16.4,14.4 U$7.2 | U$12.GND_7 U$12.GND_6 U$12.GND_5 U$12.GND_4 U$12.GND_3 U$12.GND_2 U$12.GND_1 1.35,1.45 v2.8,1.45 | U$12.GND_25 8.25,14.95 9.4,14.95 9.6,14.75 9.6,13.05 10.4,13.05 v10.4,12.45 | 26.4,13.2 C6.1
HWB  (via drill 0.2)
  Top 0.127: MC.33 29.67,3.75 31,3.75 31.3,3.95 v31.4,3.95
  Bottom 0.127: v31.4,3.95 31.76,3.69 U$11.P$1
N$1  (via drill 0.2 pad 0.25)
  Top 0.127: FB1.1 12.5,7.2 12.5,3.85 v12.8,3.85
  Bottom 0.127: C11.1 10.45,5.25 11.2,5.25 11.2,4.35 11.5,4.05 12.4,4.05 12.5,3.95 12.7,3.95 v12.8,3.85
N$3
  Bottom 0.127: 12.5,6.55 12.5,6.25
N$4  (via drill 0.2)
  Top 0.2: v22.9,12.2 22.9,12.25 21,12.25 LED_BLUE.A
  Bottom 0.127: R9.1 22.9,12.46 v22.9,12.2
N$5
  Top 0.254: R2.1 19.35,12.55 LED_YELLOW.A
N$8
  Bottom 0.127: U$19.PIN1 12.5,4.35 13.7,4.35 13.9,4.15 13.9,1.9 U$20.1
N$11  (via drill 0.2)
  Top 0.127: R4.2 3.3,14.25 v3.3,13.05 | v4.5,13.05 4.5,13.35 12.6,13.35 12.6,14.05 13,14.45 14.3,14.45 14.3,14.95 14.7,15.35 32.1,15.35 32.6,14.85 32.6,13.95 32.3,13.65 30.2,13.65 30,13.45 30,13.25 29.8,13.05 28.6,13.05 28.19,12.64 MC.4
  Bottom 0.127: v3.3,13.05 v4.5,13.05
N$23  (via drill 0.2)
  Top 0.127: MC.3 28.69,12.44 28.9,12.65 v32.1,12.65 | v33.1,14.45 33.1,14.85 32.3,15.65 14.5,15.65 14,15.15 14,14.75 12.9,14.75 12.3,14.15 12.3,13.65 7,13.65 7,14.25 R5.2
  Bottom 0.127: v32.1,12.65 32.1,13.45 v33.1,14.45
P0_2
  Bottom 0.127: U$12.P0_2 9.95,10.2 10.8,9.35 BLE_CTS.PIN1
P0_4
  Bottom 0.127: U$12.P0_4 8.25,11.75 9.5,11.75 9.6,11.65 9.6,11.05 10.6,11.05 11,11.45 11,13.86 U$13.PIN2
P0_5  (via drill 0.2)
  Top 0.127: v10.4,11.65 10.4,10.55 10.8,10.15 v11.4,10.15
  Bottom 0.127: U$12.P0_5 9.65,12.6 9.8,12.45 9.8,12.05 10.2,11.65 v10.4,11.65 | U$14.PIN2 12.5,9.55 12,9.55 11.7,10.15 v11.4,10.15
P1_5  (via drill 0.2)
  Top 0.127: v1.9,15.75 1.9,15.95 10,15.95 v10,15.35
  Bottom 0.127: U$12.P1_5 2.77,15.75 v1.9,15.75 | U$16.PIN1 9.99,15.65 v10,15.35
P1_6  (via drill 0.2)
  Top 0.127: v6.3,10.95 7,10.95 7,6.45 7.6,6.45 7.6,5.65 10.1,5.65 U$15.PIN1
  Bottom 0.127: U$12.P1_6 6.25,11 v6.3,10.95
P2_1  (via drill 0.2)
  Top 0.127: v6.4,8.55 6.7,8.25 6.7,6.15 7.3,6.15 7.3,5.35 9.5,5.35 9.5,1.85 11.41,1.85 U$20.3
  Bottom 0.127: U$12.P2_1 6.4,8.6 v6.4,8.55
P2_2  (via drill 0.2)
  Top 0.127: v5.9,7.75 5.9,7.65 6.4,7.15 6.4,5.85 7,5.85 7,5.05 9.2,5.05 9.2,1.45 10.5,1.45 10.88,0.95 12.7,0.95 12.71,0.96 U$20.2
  Bottom 0.127: U$12.P2_2 5.9,7.8 v5.9,7.75
RESET  (via drill 0.2)
  Top 0.127: 20.2,6.75 20.9,6.75 v20.9,7.15 | v20.9,9.55 23.86,9.55 MC.13
  Top 0.2: v20.3,8.05 20.2,8.05 20.2,7.54 | 20.2,7.54 20.2,6.75 20.2,6.45 18.5,6.45 18.5,4.55 17.3,4.55 17.31,4.54 U$9.1 | R3.2 20.2,7.54
  Bottom 0.127: C5.1 20.55,11.55 21.1,11.55 21.1,13.35 25.4,13.35 25.88,13.83 U$7.10 | v20.9,9.55 v20.9,7.15
  Bottom 0.2: C5.1 v20.3,8.05
RXI  (via drill 0.2)
  Top 0.127: v25.6,12.55 25.6,13.65 24.21,13.65 24.21,14.45 U$7.8 | v26.6,6.25 26.6,6.15 24.5,6.15 24.48,6.13 MC.20
  Bottom 0.127: v25.6,12.55 25.88,12.55 25.88,10.95 26.4,10.95 26.4,6.55 v26.6,6.25
TXO  (via drill 0.2)
  Top 0.127: U$7.7 22.8,14.49 22.8,13.65 23.5,13.65 23.8,13.35 24.8,13.35 24.8,12.05 25,11.85 v25.3,11.85 | v24.8,5.65 MC.21
  Bottom 0.127: v25.3,11.85 25.3,10.65 26.1,10.65 26.1,5.95 25.8,5.65 v24.8,5.65
UCAP  (via drill 0.2)
  Top 0.127: MC.6 v27.21,11.84 v27.2,11.85
  Bottom 0.127: 26.35,11.85 v27.2,11.85
  Bottom 0.2: C6.2 26.35,11.85
VCC  (via drill 0.2, 0.2 pad 0.25)
  Top 0.127: R3.1 19.3,8.65 20.5,8.65 20.8,8.95 21.26,8.95 21.4,9.09 MC.14 24.46,9.09 24.7,8.85 25.5,8.85 26.9,7.45 v26.9,7.35 28.4,5.85 | MC.7 26.71,10.44 v27.15,10.05 28.8,10.05 29.17,10.32 MC.2 29.2,10.98 29.2,11.65 30.2,11.65 30.2,11.05 30.55,10.7 MC.44 | MC.34 29.6,5.15 29.1,5.65 28.6,5.65 28.4,5.85 | v15.4,8.05 15.4,8.95 16.45,8.95 U$4.5 | v9.95,9.25 9.85,9.35 7.89,9.35 | 7.89,9.35 C15.1 C14.1 | 7.89,9.35 C16.1 C17.1 6.7,11.45 v6.3,11.85 | v3.4,2.75 3.45,2.7 C8.1 C9.1 C10.1 | MC.24 25.25,4.85 25.85,5.45 28.4,5.45 28.4,5.85
  Top 0.2: U$4.5 18,9 C7.1
  Top 0.254: C4.1 R2.2 | R2.2 16.6,12.6 16.6,13.33 U$7.3 | R2.2 16.6,12.5 16.6,11.15 17.07,10.68 C2.+ 16.5,9.98 U$4.5 | C7.1 R3.1
  Bottom 0.127: v27.15,10.05 26.7,10.05 26.7,7.55 v26.9,7.35 | v9.95,9.25 10,9.2 10,7.05 10.7,6.35 11.4,6.85 11.4,8.05 v15.4,8.05 | U$12.DVDD 2.35,14.2 2.7,13.85 6.8,13.85 6.9,13.75 6.9,11.85 | 6.9,11.85 6.9,7.55 6.6,7.25 3.4,7.25 | 3.4,7.25 2.9,7.25 2.7,7.05 1.4,7.05 U$12.AVDD | v6.3,11.85 6.9,11.85 | v3.4,2.75 3.4,7.25
VIN
  Top 0.127: FB1.2 11.7,9.05 13,9.05
  Top 0.2: U$1.V 5.2,9.15 5.2,13.05 13,13.05
  Top 0.254: 13,9.05 13,7.15 13.85,7.15 U$4.3 13.9,5.98 C1.+ | U$4.1 13.05,9 13,9.05 | 13,9.05 13,13.05 13,13.97 13.02,13.97 13.1,14.05 14.6,14.05 15.07,14.52 U$7.1
XTAL1
  Top 0.127: MC.17 22.96,7.61 22.9,7.55 22.9,6.95 22,6.95 22,6.75 21.3,6.05 U$2.P$1
XTAL2
  Top 0.127: U$2.P$3 19.6,5.25 19.6,6.15 20.5,6.15 20.5,6.45 21.2,6.45 21.6,6.85 21.6,7.25 22.6,7.25 22.6,8.05 22.66,8.11 MC.16

### Text on the board
tNames: VIN | GND | VCC | D4 | D3 | D2 | TX | RX | DTR | RST | A5 | A4 | A3 | A2 | A1 | A0 | AREF | D13 | rev: / 9 | BLE | D17 | D16 | D15 | D14 | femtoduino.com | FemtoduinoBLE | DD | DC | RS | SS | MO | MI | D5 | D6 | D7 | D8 | D9 | SCK | D10 | D11 | D12 | HWB